# Altium schematic sheet PowerSupply.SchDoc
size A3
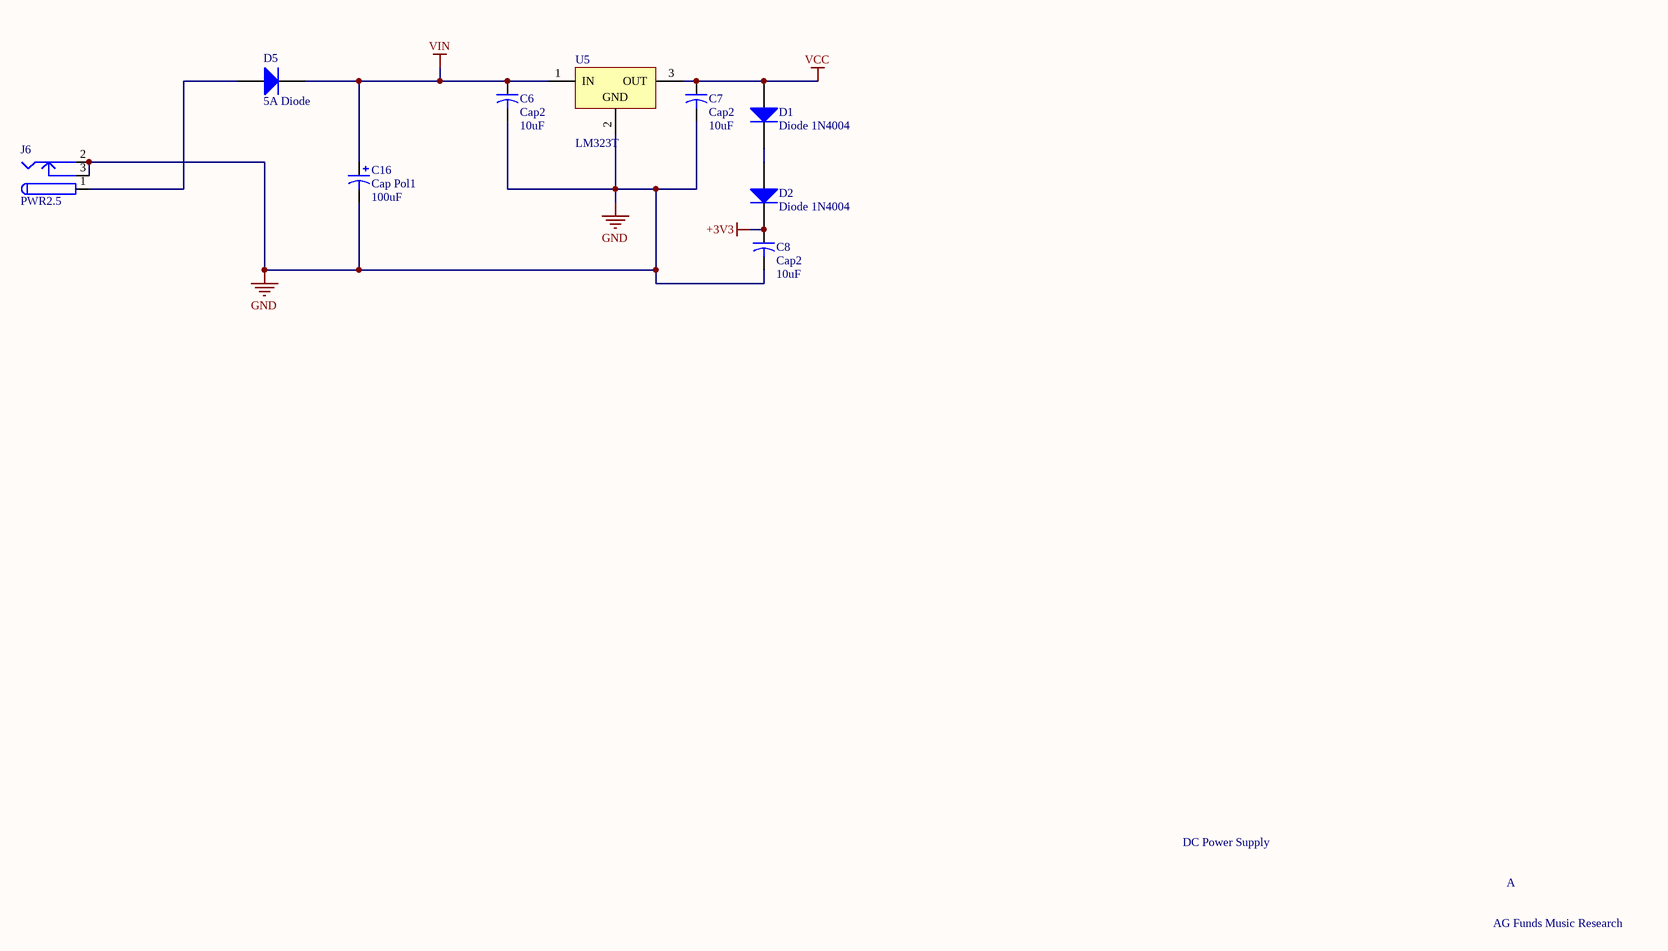
[diagram p0: PowerSupply.SchDoc]

## Parts
C6  Cap2  value 10uF  [CAPR5-4X5]
C7  Cap2  value 10uF  [CAPR5-4X5]
C8  Cap2  value 10uF  [CAPR5-4X5]
C16  Cap Pol1  value 100uF  [RB7.6-15]
D1  Diode 1N4004  [DO-41]
D2  Diode 1N4004  [DO-41]
D5  5A Diode  [DO-201AD]
J6  PWR2.5  [PJ-102B]
U5  LM323T  [TO220ABN]

## Nets
+3V3: C8.1 D2.2(K)
GND: C6.2 C7.2 C8.2 C16.2 J6.2 J6.3 U5.2(GND)
VCC: C7.1 D1.1(A) U5.3(OUT)
VIN: C6.1 C16.1 D5.2(K) U5.1(IN)
NetD1_2: D1.2(K) D2.1(A)
NetD5_1: D5.1(A) J6.1

## Notes on the sheet
- DC Power Supply
- A
- AG Funds Music Research

## Library data of the parts
C6-C8 = Cap2: Capacitor; Published: 23-Sep-2002; PackageReference: CAPR5-4X5; Publisher: Altium Limited; PackageDescription: Capacitor; 2 Leads
C16 = Cap Pol1: Polarized Capacitor (Radial); Published: 8-Jun-2000; LatestRevisionDate: 17-Jul-2002; LatestRevisionNote: Re-released for DXP Platform.; PackageReference: RB7.6-15; Publisher: Altium Limited; PackageDescription: Polarized Capacitor (Radial); 2 Leads
D1 D2 = Diode 1N4004: 1 Amp General Purpose Rectifier; Published: 8-Jun-2000; LatestRevisionDate: 17-Jul-2002; LatestRevisionNote: Re-released for DXP Platform.; DatasheetVersion: 1998; PackageVersion: Aug-1999; PackageReference: DO-41; Publisher: Altium Limited; PackageDescription: Diode, Axial; Body 5.2 x 2.7 mm (LxDia. max), Lead Dia. 0.86 mm (max); Code_JEDEC: DO-204-AL; ComponentLink1Description: Manufacturer Link; ComponentLink1URL: http://www.fairchildsemi.com/; ComponentLink2Description: Datasheet; ComponentLink2URL: http://www.fairchildsemi.com/ds/1N%2F1N4001.pdf
D5 = Diode 1N5404: 3 Amp General Purpose Rectifier; Published: 8-Jun-2000; LatestRevisionDate: 17-Jul-2002; LatestRevisionNote: Re-released for DXP Platform.; DatasheetVersion: 1998; PackageVersion: Aug-1999; PackageReference: DO-201AD; Publisher: Altium Limited; PackageDescription: Diode, Axial; Body 9.5 x 5.6 mm (LxDia. max), Lead Dia. 1.32 mm (max); ComponentLink1Description: Manufacturer Link; ComponentLink1URL: http://www.fairchildsemi.com/; ComponentLink2Description: Datasheet; ComponentLink2URL: http://www.fairchildsemi.com/ds/1N%2F1N5400.pdf
J6 = PWR2.5: CUI Inc. PJ-102B Low Voltage Power Supply Connector; Published: 17-Dec-2003; DatasheetDocument: 09-May-2002; Publisher: Altium Limited; ComponentLink1Description: Manufacturer Link; ComponentLink1URL: http://domino.kycon.com/internet/Products.html
U5 = LM323T: Three Terminal 3A-5V Positive Voltage Regulator; Published: 24-Aug-2001; LatestRevisionDate: 17-Jul-2002; LatestRevisionNote: Re-released for DXP Platform.; DatasheetVersion: Mar-1993; PackageVersion: Jun-1998; PackageReference: TO220ABN; Publisher: Altium Limited; PackageDescription: TO, Thru-Hole, Vertical, Heatsink Mounted; 3 In-Line Leads; Pitch 2.54 mm; Pin sequence 1, 3, 2; ComponentLink1Description: Manufacturer Link; ComponentLink1URL: http://www.st.com/